# EAGLE design Main2 (EAGLE 8.1.1)

## Sheet 1 of 2
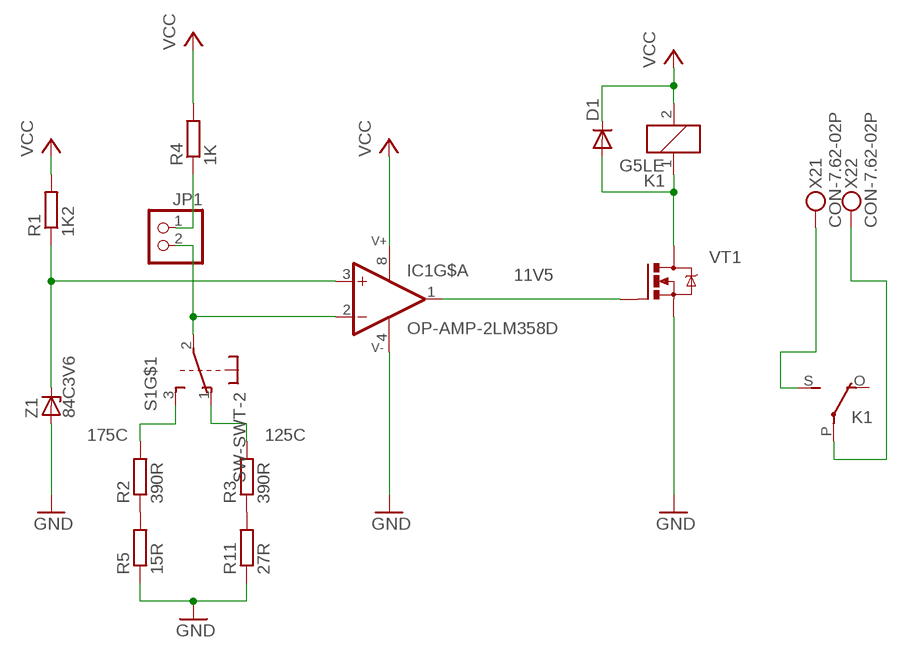
[diagram p0: schematic, sheet 1]

### Parts
D1  DIODE_ES1J  [DO214AC]
IC1  OP-AMP-2LM358D  [SO8]
JP1  PINHD-1X2  [1X02]
K1  G5LE  [G5LE]
R1  1K2  R_1206  [R1206]
R2  390R  R_0805  [R0805]
R3  390R  R_0805  [R0805]
R4  1K  R_1206  [R1206]
R5  15R  R_0805  [R0805]
R11  27R  R_0805  [R0805]
S1  SW-SWT-2  [SWT-2]
VT1  FET-NPF-2X2  [POWERFLAT-2X2]
X2  CON-7.62-02P  [KF25C-7.62-02P-13]
Z1  84C3V6  ZENER_SOT23  [SOT23]

### Nets
GND: IC1.4(G$PWR:V-) R5.1 R11.1 VT1.S VT1.S4(S) Z1.1(A) ; also sheet 2
N$1: IC1.1(G$A:OUT) VT1.G3(G)
N$2: IC1.3(G$A:+IN) R1.1 Z1.3(C)
N$3: IC1.2(G$A:-IN) JP1.2 S1.2
N$4: R2.2 S1.3
N$5: R3.2 S1.1
N$6: JP1.1 R4.1
N$7: R2.1 R5.2
N$9: K1.S(2:S) X2.P$1
N$10: K1.P(2:P) X2.P$2
N$23: R3.1 R11.2
N$24: D1.A K1.1 VT1.D VT1.D1(D) VT1.D2(D) VT1.D5(D) VT1.D6(D)
VCC: D1.C IC1.8(G$PWR:V+) K1.2 R1.2 R4.2 ; also sheet 2
Unconnected: IC1.5(G$B:+IN) IC1.6(G$B:-IN) IC1.7(G$B:OUT) K1.O(2:O) S1.4 S1.5 S1.6

### Notes on the sheet
- 11V5
- 175C | 125C

## Sheet 2 of 2
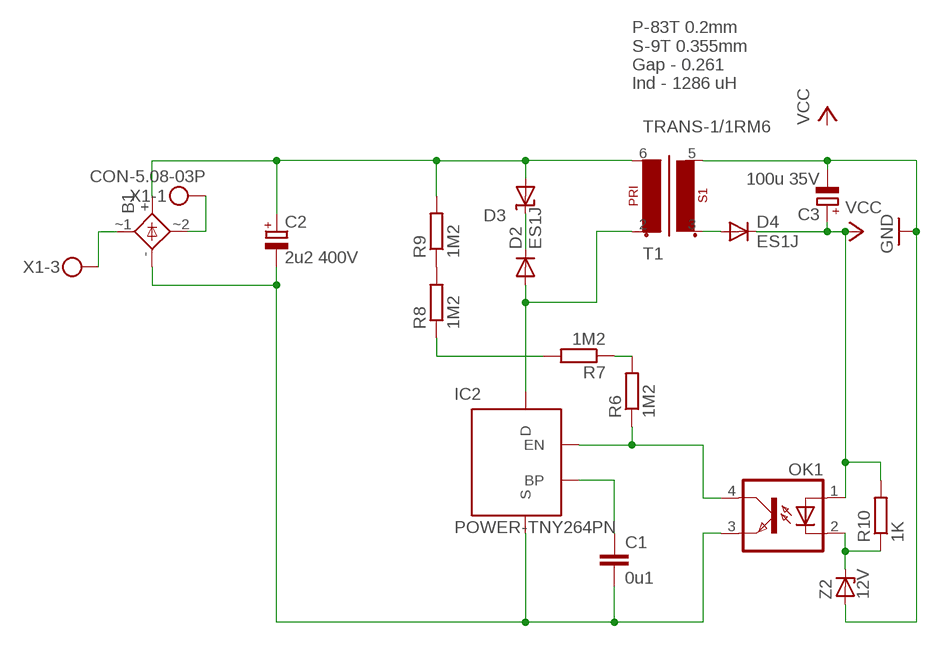
[diagram p1: schematic, sheet 2]

### Parts
B1  RECTIFIERSOIC-8  [SOIC-4]
C1  0u1  CAP_0805  [C0805]
C2  2u2 400V  CAP-POL_E2.5-7  [E2,5-7]
C3  100u 35V  CAP-POL_E3.5-8  [E3,5-8]
D2  ES1J  DIODE_ES1J  [DO214AC]
D3  SUPRESSORDO-204AC  [DO15-12]
D4  ES1J  DIODE_ES1J  [DO214AC]
IC2  POWER-TNY264PN  [DIP-8B]
OK1  OPTOTRANSPC817  [DIL04]
R6  1M2  R_0805  [R0805]
R7  1M2  R_0805  [R0805]
R8  1M2  R_0805  [R0805]
R9  1M2  R_0805  [R0805]
R10  1K  R_1206  [R1206]
T1  TRANS-1/1RM6  [RM6]
X1  CON-5.08-03P  [MKDSN1,5/3-5,08]
Z2  12V  ZENER_MINIMELF  [MINIMELF]

### Nets
GND: C3.- T1.5(S1-2) Z2.A ; also sheet 1
N$8: C1.1 IC2.1(BP)
N$11: IC2.4(EN) OK1.4(COL) R6.1
N$12: B1.- C1.2 C2.- IC2.2(S) IC2.3(S) IC2.7(S) IC2.8(S) OK1.3(EMIT)
N$13: R6.2 R7.1
N$14: R7.2 R8.1
N$15: R8.2 R9.1
N$16: B1.+ C2.+ D3.A R9.2 T1.6(P1-2)
N$17: D2.A IC2.5(D) T1.2(P1-1)
N$18: D2.C D3.C
N$19: B1.~2(AC2) X1.1
N$20: D4.A T1.3(S1-1)
N$21: OK1.2(C) R10.1 Z2.C
N$22: B1.~1(AC1) X1.3
VCC: C3.+ D4.C OK1.1(A) R10.2 ; also sheet 1
Unconnected: X1.2

### Notes on the sheet
- P-83T 0.2mm
  S-9T 0.355mm
  Gap - 0.261
  Ind - 1286 uH

## Library data of the parts
B1 = Namenlos:RECTIFIER: DIOTEC RECTIFIER
C1 = Namenlos:CAP_
C2 C3 = Namenlos:CAP-POL_
D1 D2 D4 = Namenlos:DIODE_
D3 = Namenlos:SUPRESSOR
IC1 = Namenlos:OP-AMP-2
IC2 = Namenlos:POWER-TNY264PN
JP1 = pinhead:PINHD-1X2: PIN HEADER
K1 = relay:G5LE: RELAY 1 x switch, 10 A/120 V AC, 8 A/30 V DC, Omron; OC_FARNELL: unknown; OC_NEWARK: unknown
OK1 = Namenlos:OPTOTRANS: SHARP OPTO COUPLER; MPN: PC817X4J000F; OC_FARNELL: 9707727; OC_NEWARK: 97K7059
R1-R11 = Namenlos:R_
S1 = Namenlos:SW-SWT-2
T1 = Namenlos:TRANS-1/1
VT1 = Namenlos:FET-N
X1 = Namenlos:CON-5.08-03P: MKDSN 1,5/ 3-5,08 Printklemme Nennstrom: 13,5 A Nennspannung: 250 V Rastermaß: 5,08 mm Polzahl: 3 Anschlussart: Schraubanschluss Montage: Löten Anschlussrichtung Leiter/Platine: 0 ° Artikelnummer: 1729131 Source: http://eshop.phoenixcontact.com .. 1729131.pdf
X2 = Namenlos:CON-7.62-02P
Z1 Z2 = Namenlos:ZENER_

## Board
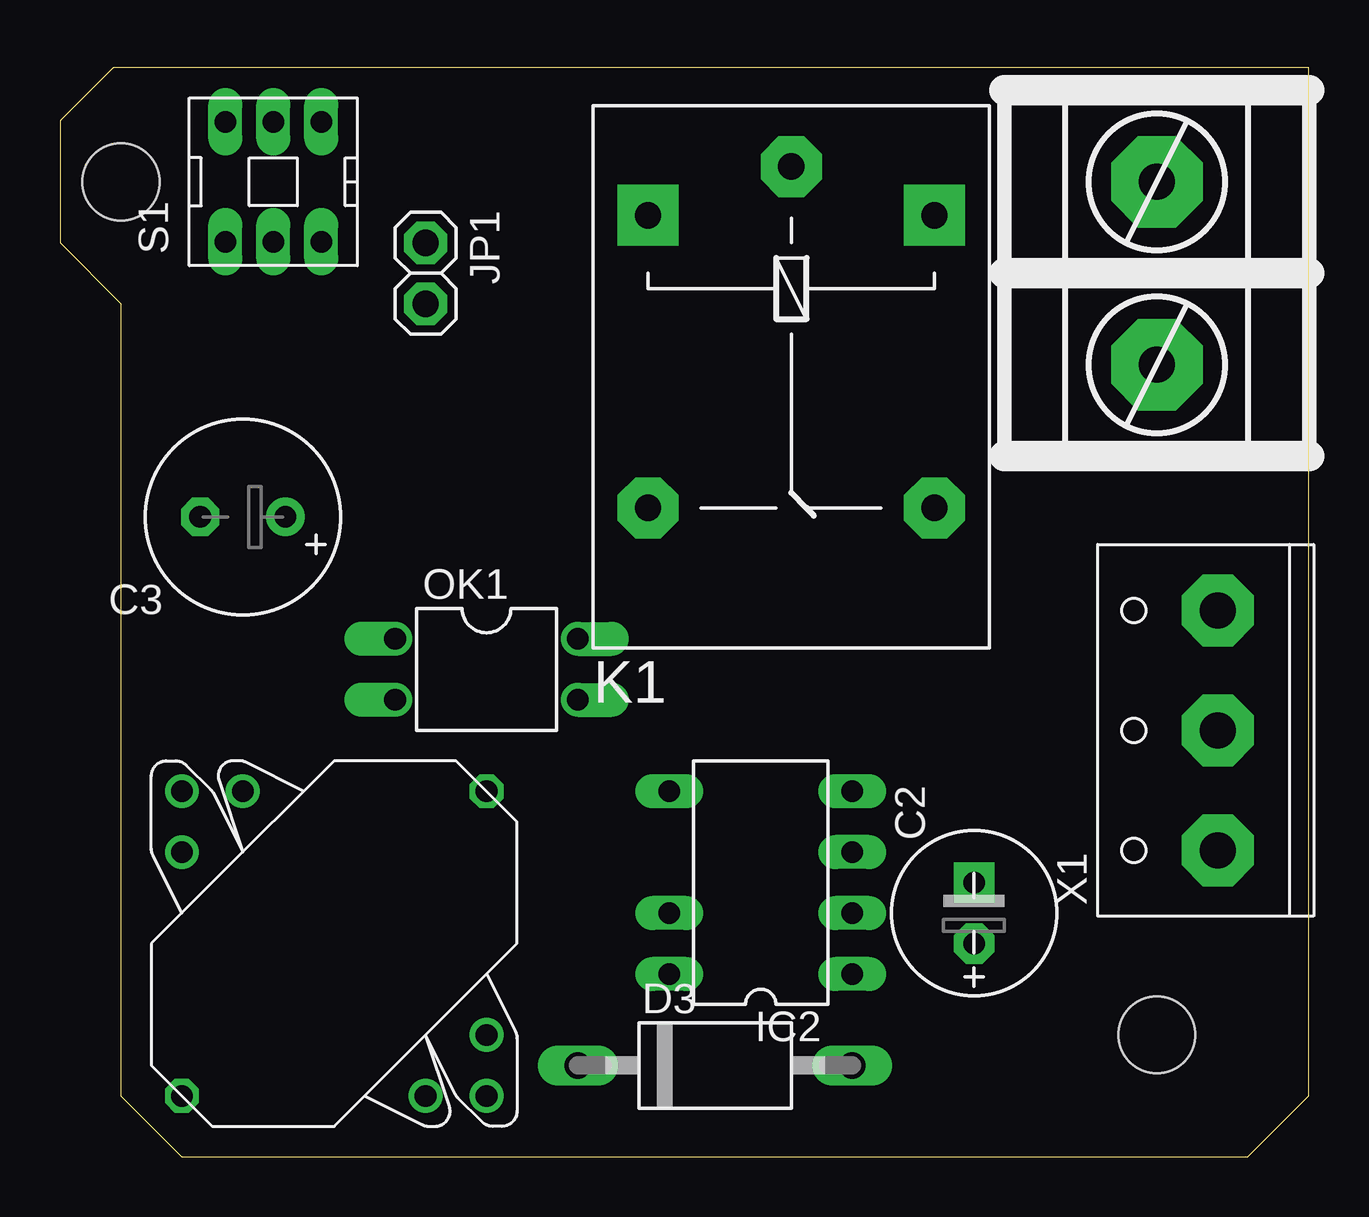
[diagram p2: board, top side]
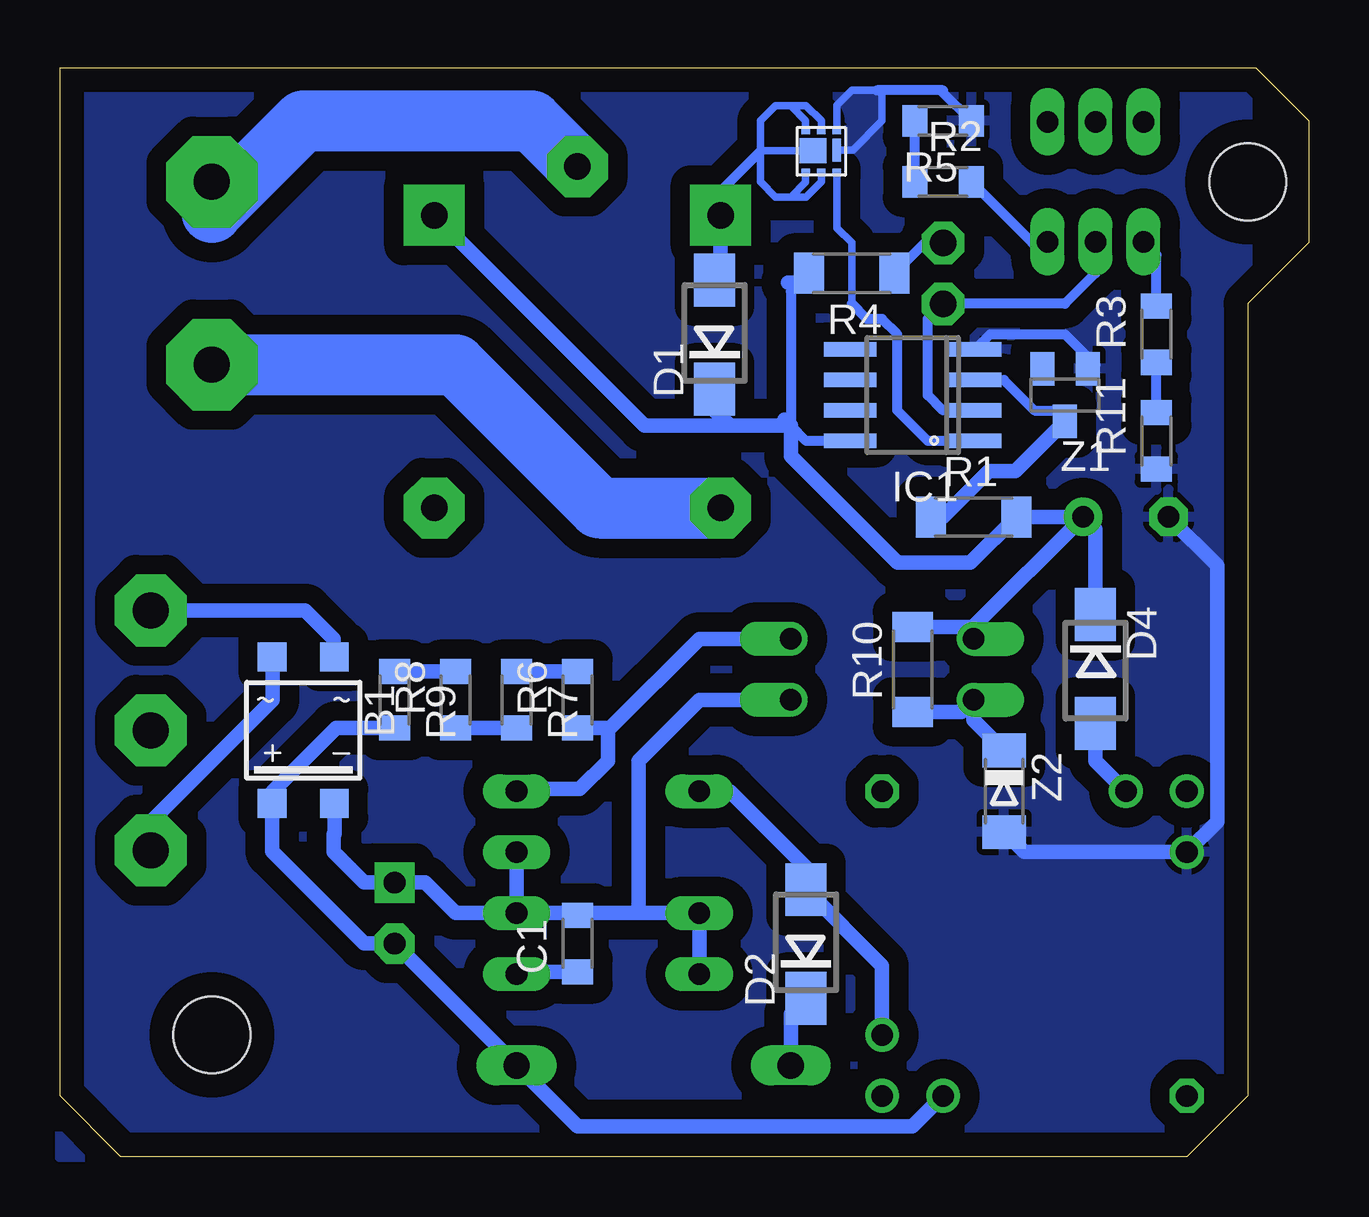
[diagram p3: board, bottom side, seen from below]

Size 52.05 x 45.39 mm. Coordinates in mm from the lower left corner, seen from the top.
Outline: 2.54,35.56 2.54,2.54 5.08,0 49.51,0 52.05,2.54 52.05,45.39 2.21,45.39 0,43.18 0,38.1 2.54,35.56
Copper layers (1*16): Top 0.035mm / dielectric 1.5mm / Bottom 0.035mm
Design rules "EagleDesignRules": minimum track width 0.2mm, minimum drill 0.3mm, track to track 0.2mm, track to pad 0.2mm, pad to pad 0.2mm, via to via 0.2mm, smd to smd 0.2mm, copper to edge 1mm, drill to drill 0.2mm, minimum pad ring 10mil, minimum via ring 8mil, stop-mask expansion 4mil, vias tented up to drill 0mil, thermal gap 0.25mm
Holes 3.2 mm at 2.54,40.64 45.72,5.08

### Footprints (pad centres in the part's own frame; a part is rotated, then mirrored left to right if it is on the bottom)
SOIC-4 = smd 1.2 x 1.2: + 1.3,3.05; - -1.3,3.05; ~1 -1.3,-3.05; ~2 1.3,-3.05
C0805 = smd 1.05 x 1.3: 1 -1.175,0; 2 1.175,0
E2,5-7 = drill 0.9 pad 1.676 octagon: + -1.27,0 | drill 0.9 pad 1.676 square: - 1.27,0
E3,5-8 = drill 0.9 pad 1.6: + -1.778,0 | drill 0.9 pad 1.6 octagon: - 1.778,0
DO214AC = smd 2.2 x 1.7: A 2.25,0; C -2.285,0
DO15-12 = drill 1.1 pad 1.676 long: A 5.08,0; C -6.35,0
SO8 = smd 0.6 x 2.2: 1 -1.905,-2.6; 2 -0.635,-2.6; 3 0.635,-2.6; 4 1.905,-2.6; 5 1.905,2.6; 6 0.635,2.6; 7 -0.635,2.6; 8 -1.905,2.6
DIP-8B = drill 0.9 long: 1 -3.81,-3.81; 2 -1.27,-3.81; 3 1.27,-3.81; 4 3.81,-3.81; 5 3.81,3.81; 7 -1.27,3.81; 8 -3.81,3.81
1X02 = drill 1.1 pad 1.778 octagon: 1 -1.27,0; 2 1.27,0
G5LE = drill 1.1 pad 2.54 square: 1 -7.493,-5.969; 2 -7.493,5.969 | drill 1.1 pad 2.54 octagon: O 4.699,5.969; P -9.525,0; S 4.699,-5.969
DIL04 = drill 0.9 pad 1.27 offset: 1 -1.27,-3.81; 2 1.27,-3.81; 3 1.27,3.81; 4 -1.27,3.81
R1206 = smd 1.25 x 1.7: 1 -1.775,0; 2 1.775,0
R0805 = smd 1.05 x 1.3: 1 -1.175,0; 2 1.175,0
SWT-2 = drill 0.9 long: 1 -2.497,2; 2 -2.497,0; 3 -2.497,-2; 4 2.503,2; 5 2.503,0; 6 2.503,-2
RM6 = drill 0.9: 1 -6.35,6.35; 2 -6.35,3.81; 3 3.81,-6.35; 4 6.35,-6.35; 5 6.35,-3.81; 6 -3.81,6.35 | drill 0.9 octagon: S1 -6.35,-6.35; S2 6.35,6.35
POWERFLAT-2X2 = smd 1.125 x 1.05: D -0.34,0.028 | smd 0.35 x 0.3: D1 -0.65,-0.875; D2 0,-0.875; D5 0,0.875; D6 -0.65,0.875; G3 0.65,-0.875; S4 0.65,0.875 | smd 0.35 x 0.95: S 0.65,0.05
MKDSN1,5/3-5,08 = drill 1.5 pad 3 octagon: 1 -5,0; 2 0,0; 3 5,0
KF25C-7.62-02P-13 = drill 1.5 pad 3.81 octagon: P$1 -3.81,0; P$2 3.81,0
SOT23 = smd 1 x 1.4: 1 -0.95,-1.1; 2 0.95,-1.1; 3 0,1.1
MINIMELF = smd 1.4 x 1.8: A 1.7,0; C -1.7,0

### Placement (x,y rotation side)
B1  41.91,17.78 180 bottom
C1  30.48,8.89 90 bottom
C2  38.1,10.16 90 top
C3  7.62,26.67 180 top
D1  24.77,34.29 90 bottom
D2  20.95,8.89 90 bottom
D3  27.94,3.81 0 top
D4  8.89,20.32 270 bottom
IC1  16.51,31.75 90 bottom
IC2  29.21,11.43 90 top
JP1  15.24,36.83 270 top
K1  30.48,31.75 270 top
OK1  17.78,20.32 270 top
R1  13.97,26.67 0 bottom
R2  15.24,40.64 0 bottom
R3  6.35,34.29 90 bottom
R4  19.05,36.83 180 bottom
R5  15.24,43.18 180 bottom
R6  30.48,19.05 90 bottom
R7  33.02,19.05 270 bottom
R8  35.56,19.05 90 bottom
R9  38.1,19.05 270 bottom
R10  16.51,20.32 90 bottom
R11  6.35,29.84 90 bottom
S1  8.89,40.64 90 top
T1  11.43,8.89 180 top
VT1  20.32,41.91 0 bottom
X1  48.26,17.78 90 top
X2  45.72,36.83 90 top
Z1  10.16,31.75 180 bottom
Z2  12.7,15.24 270 bottom

### Tracks (layer width: path | path; a pad name or v marks a point on that pad's centre or on a via)
GND
  Bottom 0.305: VT1.S4 19.67,43.83 19.05,44.45 18,44.45 | VT1.S 19,41.96 17.78,43.18 17.78,44.45
  Bottom 0.406: IC1.4 13.27,34.29 10.16,34.29 8.89,33.02 9.04,33.02 Z1.1 | 18,44.45 17.78,44.45 15.24,44.45 15.24,44.36 R5.1
  Bottom 0.61: C3.- 3.81,24.64 3.81,13.97 T1.5 11.86,12.7 Z2.A
  pour Bottom (isolate 0.813): 2.54,45.72 25.4,45.72 50.8,45.72 52.07,44.45 52.07,0 5.08,0 2.54,2.54
N$1
  Bottom 0.305: VT1.G3 19.67,38.72 19.05,38.1 19.05,35.56
  Bottom 0.406: IC1.1 15.88,29.84 17.14,31.12 17.14,34.29 17.78,34.92 18.41,34.92 19.05,35.56
N$2
  Bottom 0.406: Z1.3 10.62,31.12 11.43,31.12 12.7,32.38 IC1.3
  Bottom 0.61: R1.1 15.24,26.67 13.34,28.58 12.23,28.58 Z1.3
N$3
  Bottom 0.406: S1.2 8.89,36.83 10.16,35.56 JP1.2 15.88,34.92 15.88,31.75 15.24,31.12 IC1.2
N$4
  Bottom 0.406: S1.3 10.93,38.1 11.52,38.1 R2.2
N$5
  Bottom 0.406: R3.2 6.35,37.6 S1.1
N$6
  Bottom 0.406: R4.1 16,38.1 JP1.1
N$7
  Bottom 0.406: R2.1 R5.2
N$8
  Bottom 0.61: C1.1 32.93,7.71 IC2.1
N$9
  Bottom 2.54: X2.P$1 35.56,33.02 29.59,27.05 K1.S
N$10
  Bottom 2.54: K1.P 32.38,43.18 41.91,43.18 45.72,39.37 X2.P$2
N$11
  Bottom 0.61: IC2.4 33.02,15.34 30.38,15.34 29.21,16.51 29.21,17.88 | R6.1 29.21,17.88 | 29.21,17.88 29.11,17.88 25.4,21.59 OK1.4
N$12
  Bottom 0.61: IC2.8 IC2.7 27.94,10.16 | IC2.2 30.57,10.16 C1.2 30.38,10.16 27.94,10.16 | IC2.3 IC2.2 | OK1.3 25.4,19.05 27.94,16.51 27.94,10.16 | IC2.2 35.56,10.16 36.83,11.43 C2.- 39.37,11.43 40.64,12.7 40.64,13.43 40.61,13.46 B1.-
N$13
  Bottom 0.61: R6.2 R7.1
N$14
  Bottom 0.61: R7.2 R8.1
N$15
  Bottom 0.61: R8.2 R9.1
N$16
  Bottom 0.61: T1.6 16.51,1.27 30.48,1.27 D3.A C2.+ 39.37,8.89 43.21,12.73 B1.+ 43.18,14.76 43.18,15.24 40.55,17.88 R9.2
N$17
  Bottom 0.61: IC2.5 24.13,15.24 20.95,12.06 D2.A 17.78,7.96 T1.2
N$18
  Bottom 0.61: D3.C 21.59,5.97 D2.C
N$19
  Bottom 0.61: X1.1 48.26,13.97 43.18,19.05 43.18,20.8 B1.~2
N$20
  Bottom 0.61: T1.3 8.89,16.51 D4.A
N$21
  Bottom 0.61: R10.1 14.48,18.55 OK1.2 13.97,18.21 Z2.C
N$22
  Bottom 0.61: X1.3 41.83,22.78 40.64,21.59 40.64,20.86 B1.~1
N$23
  Bottom 0.406: R11.2 R3.1
N$24
  Bottom 0.305: 20.32,42.28 VT1.D | 20.32,41.6 VT1.D | VT1.D5 20.32,43.18 20.95,43.81 21.59,43.81 | 21.59,43.81 22.22,43.81 22.86,43.18 22.86,41.91 | VT1.D6 20.97,43.2 21.59,43.81 | VT1.D2 20.32,40.64 20.95,40 21.59,40 | 21.59,40 22.22,40 22.86,40.64 22.86,41.91 | VT1.D1 20.97,40.62 21.59,40 | 22.86,41.91 22.83,41.94 VT1.D
  Bottom 0.406: 20.97,42.25 VT1.D | 20.97,41.63 VT1.D | K1.1 24.51,40.26 22.86,41.91 | 20.69,41.91 VT1.D
  Bottom 0.61: K1.1 24.51,36.79 D1.A
VCC
  Bottom 0.406: R4.2 21.21,36.45 21.59,36.06 21.59,30.48 20.95,29.84 IC1.8
  Bottom 0.61: 21.71,36.45 21.21,36.45 | 21.84,30.73 21.59,30.48 | 21.59,30.48 21.59,29.21 17.14,24.77 14.1,24.77 R1.2 C3.+ | D4.C 8.89,26.16 C3.+ | OK1.1 13.97,22.1 | 13.97,22.1 C3.+ | 13.97,22.1 13.97,22.09 R10.2 | 24.13,30.48 21.59,30.48 | 24.13,30.48 27.69,30.48 K1.2 | D1.C 24.77,31.12 24.13,30.48